# EAGLE design v1 (EAGLE 6.5.0)
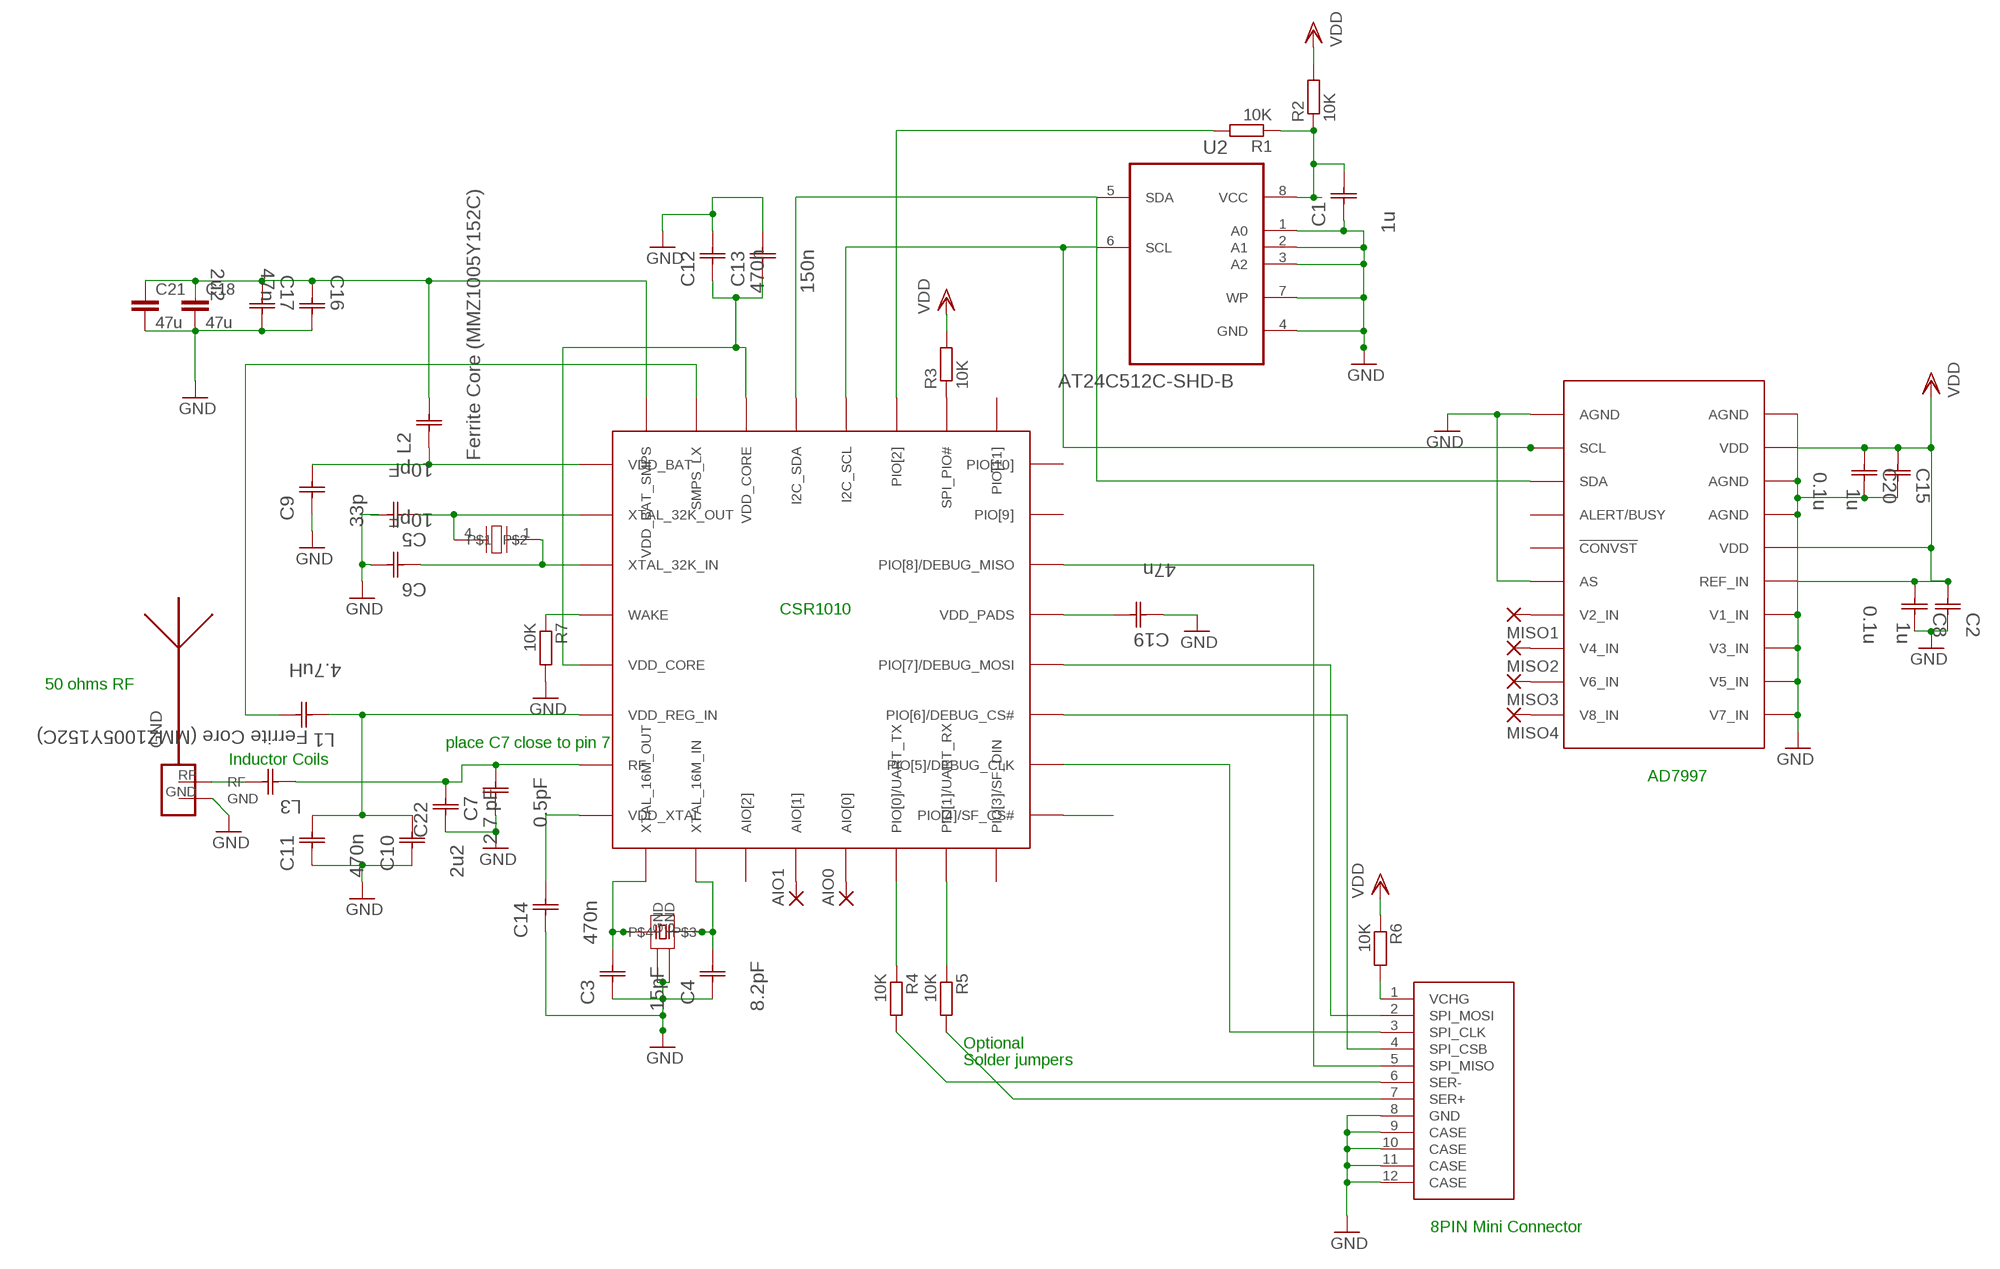
[diagram p0: schematic, sheet 1]

## Parts
AIO0  1,6/0,8  [1,6/0,8]
AIO1  1,6/0,8  [1,6/0,8]
C1  1u  UQCL2A100JAT2A/500  [CAPC1005X60N]
C2  1u  UQCL2A100JAT2A/500  [CAPC1005X60N]
C3  15pF  UQCL2A150JAT2A/500  [CAPC1005X60N]
C4  8.2pF  UQCL2A8R2CAT2A/500  [CAPC1005X60N]
C5  10pF  UQCL2A100JAT2A/500  [CAPC1005X60N]
C6  10pF  UQCL2A100JAT2A/500  [CAPC1005X60N]
C7  0.5pF  UQCL2A0R5BAT2A/500  [CAPC1005X60N]
C8  0.1u  UQCL2A100JAT2A/500  [CAPC1005X60N]
C9  33p  UQCL2A100JAT2A/500  [CAPC1005X60N]
C10  2u2  UQCL2A100JAT2A/500  [CAPC1005X60N]
C11  470n  UQCL2A100JAT2A/500  [CAPC1005X60N]
C12  470n  UQCL2A100JAT2A/500  [CAPC1005X60N]
C13  150n  UQCL2A100JAT2A/500  [CAPC1005X60N]
C14  470n  UQCL2A100JAT2A/500  [CAPC1005X60N]
C15  1u  UQCL2A100JAT2A/500  [CAPC1005X60N]
C16  47n  UQCL2A1R0BAT2A/500  [CAPC1005X60N]
C17  2u2  UQCL2A1R0BAT2A/500  [CAPC1005X60N]
C18  47u  C-EUC0805  [C0805]
C19  47n  UQCL2A100JAT2A/500  [CAPC1005X60N]
C20  0.1u  UQCL2A100JAT2A/500  [CAPC1005X60N]
C21  47u  C-EUC0805  [C0805]
C22  2.7 pF  UQCL2A0R5BAT2A/500  [CAPC1005X60N]
GND  ANTENNA_1LEFT  [SWRA117D_LEFT]
L1  4.7uH  12107C102JAT2A  [CAPC3225X127N]
L2  Ferrite Core (MMZ1005Y152C)  UQCL2A100JAT2A/500  [CAPC1005X60N]
L3  Ferrite Core (MMZ1005Y152C)  UQCL2A100JAT2A/500  [CAPC1005X60N]
MISO1  1,6/0,8  [1,6/0,8]
MISO2  1,6/0,8  [1,6/0,8]
MISO3  1,6/0,8  [1,6/0,8]
MISO4  1,6/0,8  [1,6/0,8]
R1  10K  R-EU_R0402  [R0402]
R2  10K  R-EU_R0402  [R0402]
R3  10K  R-EU_R0402  [R0402]
R4  10K  R-EU_R0402  [R0402]
R5  10K  R-EU_R0402  [R0402]
R6  10K  R-EU_R0402  [R0402]
R7  10K  R-EU_R0402  [R0402]
U2  AT24C512C-SHD-B  [SOIC127P798X216-8N]
U$1  CSR1010A05-IQQM-R  [CSR1010A05-IQQM-R]
U$2  8PIN_SMT_CONNECTOR  [8PIN_SMT_CONNECTOR]
U$3  TSX3225  [TSX3225]
U$4  SSP-T7-F  [SSP-T7-F]
U$5  AD7997  [AD7997]

## Nets
GND: C1.2(C1) C2.2(C1) C3.2(C1) C4.2(C1) C6.1(C2) C7.2(C1) C8.2(C1) C9.2(C1) C10.2(C1) C11.2(C1) C12.1(C2) C13.1(C2) C14.2(C1) C15.2(C1) C16.1(C2) C17.1(C2) C18.2 C19.2(C1) C20.2(C1) C21.2 C22.2(C1) R7.2 U2.1(A0) U2.2(A1) U2.3(A2) U2.4(GND) U2.7(WP) U$2.8(GND) U$2.9(CASE) U$2.10(CASE) U$2.11(CASE) U$2.12(CASE) U$3.2(GND) U$3.4(GND) U$5.P$01(AGND) U$5.P$03(AGND) U$5.P$04(AGND) U$5.P$07(V1_IN) U$5.P$08(V3_IN) U$5.P$09(V5_IN) U$5.P$010(V7_IN) U$5.P$015(AS) U$5.P$020(AGND)
N$1: R3.1 U$1.SPI_PIO#
N$3: R1.2 U$1.PIO[2]
N$4: C1.1(C2) R1.1 R2.1 U2.8(VCC)
N$18: U$1.PIO[8]/DEBUG_MISO U$2.5(SPI_MISO)
N$19: L1.2(C2) U$1.SMPS_LX
N$20: R4.2 U$2.6(SER-)
N$23: U$1.PIO[4]/SF_CS#
N$26: C5.2(C1) U$1.XTAL_32K_OUT U$4.4
N$27: C6.2(C1) U$1.XTAL_32K_IN U$4.1
N$28: AIO0.1(P) U$1.AIO[0]
N$29: C3.1(C2) U$1.XTAL_16M_OUT U$3.1
N$30: C4.1(C2) U$1.XTAL_16M_IN U$3.3
N$31: U$1.PIO[6]/DEBUG_CS# U$2.4(SPI_CSB)
N$32: C9.1(C2) L2.2(C1) U$1.VDD_BAT
N$33: AIO1.1(P) U$1.AIO[1]
N$35: C14.1(C2) U$1.VDD_XTAL
N$36: R5.2 U$2.7(SER+)
N$37: R4.1 U$1.PIO[0]/UART_TX
N$38: R5.1 U$1.PIO[1]/UART_RX
N$39: C10.1(C2) C11.1(C2) L1.1(C1) U$1.VDD_REG_IN
N$40: R6.2 U$2.1(VCHG)
N$43: C7.1(C2) C22.1(C2) L3.2(C1) U$1.RF
N$46: MISO1.1(P) U$5.P$014(V2_IN)
N$49: R7.1 U$1.WAKE
N$50: U$1.PIO[7]/DEBUG_MOSI U$2.2(SPI_MOSI)
N$51: U$1.PIO[5]/DEBUG_CLK U$2.3(SPI_CLK)
N$73: MISO3.1(P) U$5.P$012(V6_IN)
N$82: MISO2.1(P) U$5.P$013(V4_IN)
N$83: MISO4.1(P) U$5.P$011(V8_IN)
N$87: C19.1(C2) U$1.VDD_PADS
N$110: U2.5(SDA) U$1.I2C_SDA U$5.P$018(SDA)
N$135: C16.2(C1) C17.2(C1) C18.1 C21.1 L2.1(C2) U$1.VDD_BAT_SMPS
SCL: U2.6(SCL) U$1.I2C_SCL U$5.P$019(SCL)
VDD: C2.1(C2) C8.1(C2) C15.1(C2) C20.1(C2) R2.2 R3.2 R6.1 U$5.P$02(VDD) U$5.P$05(VDD) U$5.P$06(REF_IN)
VDD_CORE: C12.2(C1) C13.2(C1) U$1.VDD_CORE U$1.VDD_CORE@1(VDD_CORE)
Unconnected: C5.1(C2) GND.GND GND.RF L3.1(C2) U$1.AIO[2] U$1.PIO[3]/SF_DIN U$1.PIO[9] U$1.PIO[10] U$1.PIO[11] U$5.P$016(!CONVST) U$5.P$017(ALERT/BUSY)

## Notes on the sheet
- CSR1010
- 50 ohms RF
- place C7 close to pin 7
- Inductor Coils
- AD7997
- Optional
- Solder jumpers
- 8PIN Mini Connector

## Library data of the parts
AIO0 AIO1 MISO1-MISO4 = wirepad:1,6/0,8: THROUGH-HOLE PAD
C1 C2 C8-C15 C19 C20 L2 L3 = AVX_By_element14_Batch_1:UQCL2A100JAT2A/500: Capacitor 0402; MPN: UQCL2A100JAT2A/500; OC_FARNELL: -; OC_NEWARK: 32T8791; SUPPLIER: AVX; TOLERANCE: ±5%; VALUE: 10pF; VOLTAGERATING: 200V
C3 = AVX_By_element14_Batch_1:UQCL2A150JAT2A/500: Capacitor 0402; MPN: UQCL2A150JAT2A/500; OC_FARNELL: -; OC_NEWARK: 32T8795; SUPPLIER: AVX; TOLERANCE: ±5%; VOLTAGERATING: 200V
C4 = AVX_By_element14_Batch_1:UQCL2A8R2CAT2A/500: Capacitor 0402; MPN: UQCL2A8R2CAT2A/500; OC_FARNELL: -; OC_NEWARK: 32T8828; SUPPLIER: AVX; TOLERANCE: ±.25 pF; VOLTAGERATING: 200V
C5 C6 = AVX_By_element14_Batch_1:UQCL2A100JAT2A/500: Capacitor 0402; MPN: UQCL2A100JAT2A/500; OC_FARNELL: -; OC_NEWARK: 32T8791; SUPPLIER: AVX; TOLERANCE: ±5%; VOLTAGERATING: 200V
C7 = AVX_By_element14_Batch_1:UQCL2A0R5BAT2A/500: Capacitor 0402; MPN: UQCL2A0R5BAT2A/500; OC_FARNELL: -; OC_NEWARK: 32T8767; SUPPLIER: AVX; TOLERANCE: ±.1 pF; VOLTAGERATING: 200V
C16 C17 = AVX_By_element14_Batch_1:UQCL2A1R0BAT2A/500: Capacitor 0402; MPN: UQCL2A1R0BAT2A/500; OC_FARNELL: -; OC_NEWARK: 32T8778; SUPPLIER: AVX; TOLERANCE: ±.1 pF; VALUE: 1pF; VOLTAGERATING: 200V
C18 C21 = resistor:C-EU: CAPACITOR, European symbol
C22 = AVX_By_element14_Batch_1:UQCL2A0R5BAT2A/500: Capacitor 0402; MPN: UQCL2A0R5BAT2A/500; OC_FARNELL: -; OC_NEWARK: 32T8767; SUPPLIER: AVX; TOLERANCE: ±.1 pF; VALUE: 0.5pF; VOLTAGERATING: 200V
GND = ant-planar-1:ANTENNA_1
L1 = AVX_By_element14_Batch_1:12107C102JAT2A: Capacitor 1210; MPN: 12107C102JAT2A; OC_FARNELL: -; OC_NEWARK: 56J0850; SUPPLIER: AVX; TOLERANCE: ±5%; VALUE: 1000PF; VOLTAGERATING: 500V
R1-R7 = rcl:R-EU_: RESISTOR, European symbol
U2 = ATMEL-AT24C512C-SHD-B:AT24C512C-SHD-B: EEPROM, SERIAL, 512K (64KX8), 8SOIC-Wide; MPN: AT24C512C-SHD-B; OC_FARNELL: 1972003; OC_NEWARK: 68T4124; PACKAGE: 8SOIC-Wide; SUPPLIER: ATMEL
U$1 = CSR1010A05:CSR1010A05-IQQM-R
U$2 = MINI_SMT_8_PIN_CONNECTOR:8PIN_SMT_CONNECTOR
U$3 = TSX3225:TSX3225
U$4 = SSP-T7-F:SSP-T7-F
U$5 = AD7997:AD7997

## Board
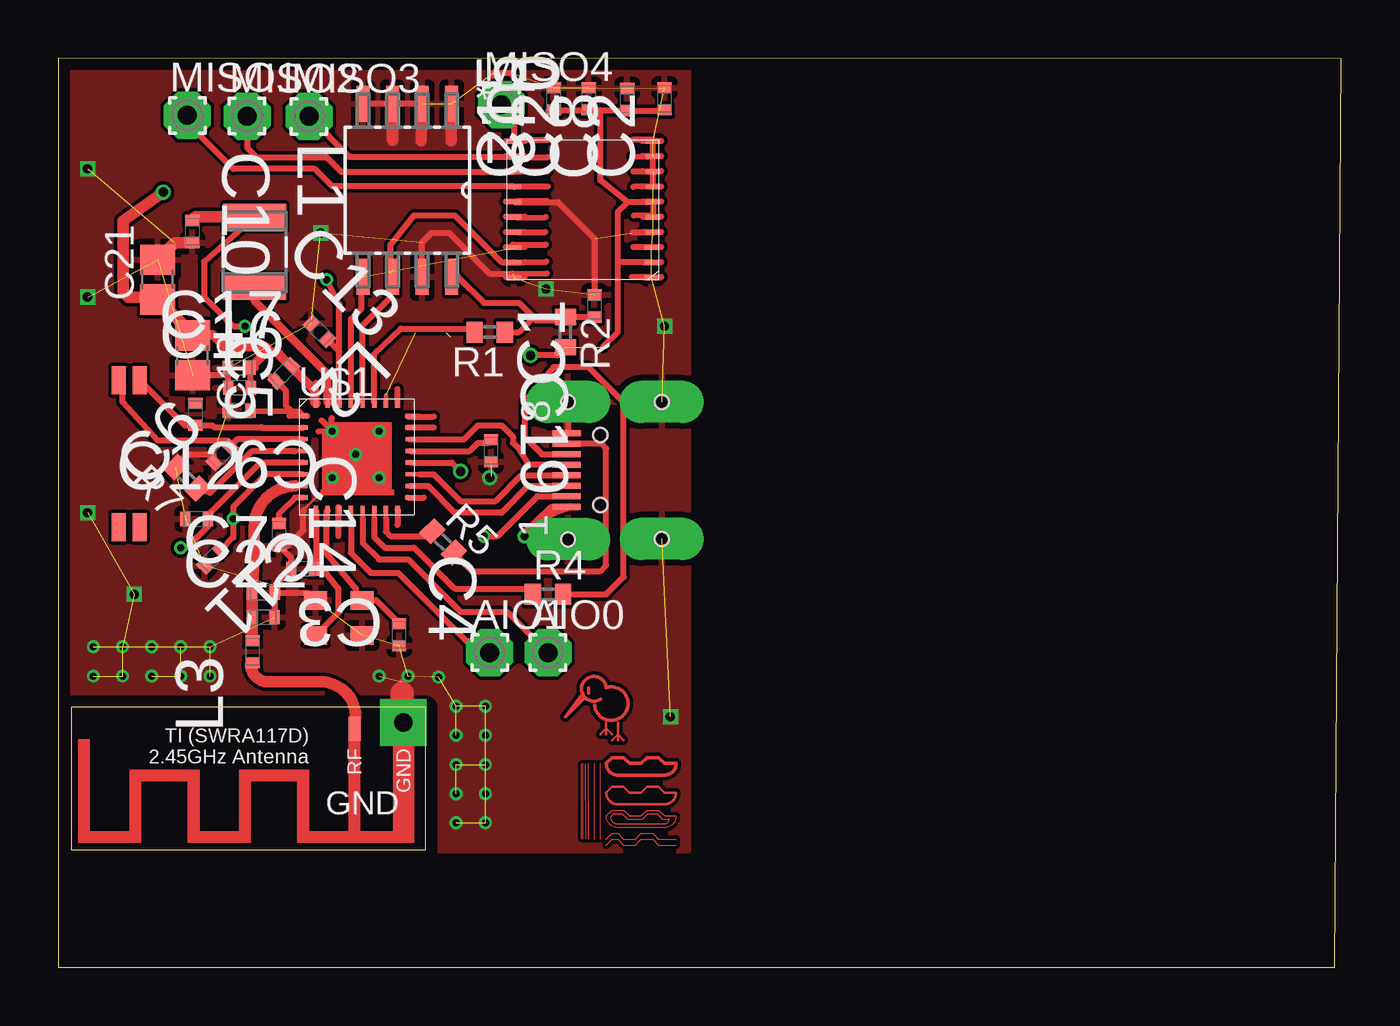
[diagram p1: board, top side]
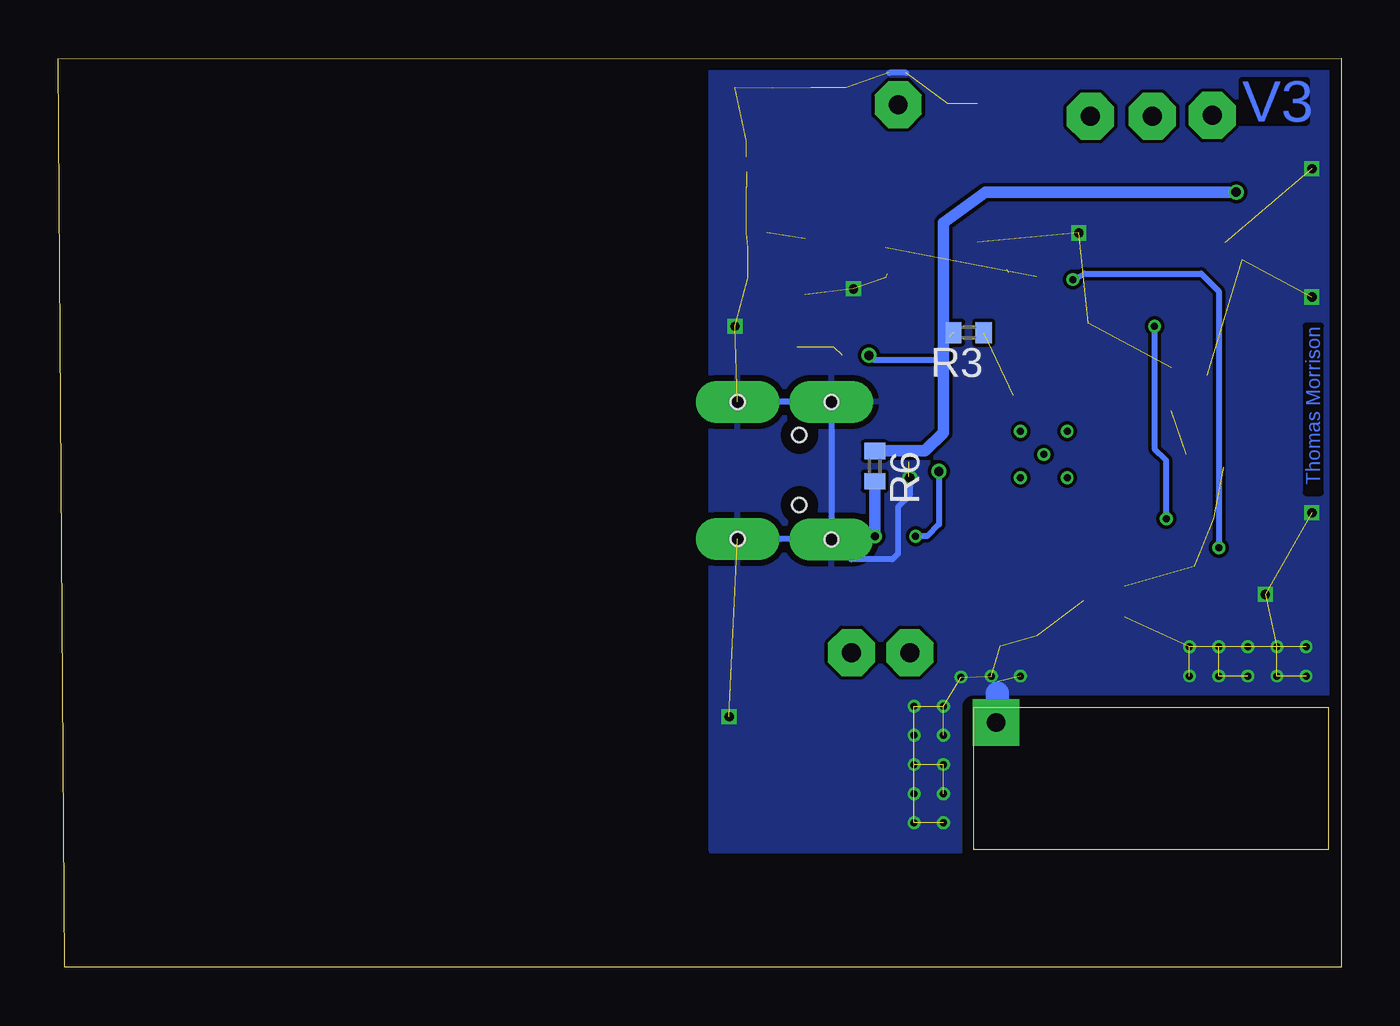
[diagram p2: board, bottom side, seen from below]

Size 55.04 x 38.99 mm. Coordinates in mm from the lower left corner, seen from the top.
Outline: 0.01,0 54.76,0 55.04,38.98 0,38.99 0.01,0
Copper layers (1*16): Top 0.035mm / dielectric 1.5mm / Bottom 0.035mm
Design rules "DRC *": minimum track width 0.15mm, minimum drill 0.2mm, track to track 0.15mm, track to pad 0.15mm, pad to pad 0.15mm, via to via 0.25mm, smd to smd 0.15mm, copper to edge 0.5mm, drill to drill 0.4mm, minimum pad ring 0.6mm, minimum via ring 0.125mm, stop-mask expansion 4mil, vias tented up to drill 0mil, thermal gap 10mil

### Footprints (pad centres in the part's own frame; a part is rotated, then mirrored left to right if it is on the bottom)
1,6/0,8 = drill 0.813 pad 1.6 octagon: 1 0,0
CAPC1005X60N = smd 0.457 x 0.61: 1 -0.483,0; 2 0.483,0
C0805 = smd 1.3 x 1.5: 1 -0.85,0; 2 0.85,0
SWRA117D_LEFT = drill 0.8 square: GND 0.45,0.25 | smd 0.508 x 1.016: RF 2.55,0.51
CAPC3225X127N = smd 1.118 x 2.692: 1 -1.499,0; 2 1.499,0
R0402 = smd 0.7 x 0.9: 1 -0.65,0; 2 0.65,0
SOIC127P798X216-8N = smd 1.549 x 0.559: 1 -3.708,1.905; 2 -3.708,0.635; 3 -3.708,-0.635; 4 -3.708,-1.905; 5 3.708,-1.905; 6 3.708,-0.635; 7 3.708,0.635; 8 3.708,1.905
CSR1010A05-IQQM-R = smd 0.186 x 0.4: AIO[0] -0.2,-0.9; AIO[1] -0.7,-0.9; AIO[2] -1.2,-0.9; I2C_SCL -0.2,3.7; I2C_SDA -0.7,3.7; PIO[0]/UART_TX 0.3,-0.9; PIO[1]/UART_RX 0.8,-0.9; PIO[2] 0.3,3.7; SMPS_LX -1.7,3.7; SPI_PIO# 0.8,3.7; VDD_CORE@1 -1.2,3.7; XTAL_16M_IN -1.7,-0.9 | smd 0.2 x 0.4: PIO[3]/SF_DIN 1.3,-0.9; PIO[11] 1.3,3.7; VDD_BAT_SMPS -2.2,3.7; XTAL_16M_OUT -2.2,-0.9 | smd 0.4 x 0.2: PIO[4]/SF_CS# 1.85,-0.35; PIO[10] 1.85,3.15; VDD_BAT -2.75,3.15; VDD_XTAL -2.75,-0.35 | smd 0.4 x 0.186: PIO[5]/DEBUG_CLK 1.85,0.15; PIO[6]/DEBUG_CS# 1.85,0.65; PIO[7]/DEBUG_MOSI 1.85,1.15; PIO[8]/DEBUG_MISO 1.85,2.15; PIO[9] 1.85,2.65; RF -2.75,0.15; VDD_CORE -2.75,1.15; VDD_PADS 1.85,1.65; VDD_REG_IN -2.75,0.65; WAKE -2.75,1.65; XTAL_32K_IN -2.75,2.15; XTAL_32K_OUT -2.75,2.65
8PIN_SMT_CONNECTOR = smd 0.26 x 1.2: 1 -1.32,2.83; 2 -0.87,2.83; 3 -0.42,2.83; 4 0.03,2.83; 5 0.48,2.83; 6 0.93,2.83; 7 1.38,2.83; 8 1.83,2.83 | drill 0.6 long: 9 3.18,2.755; 10 3.18,-1.27; 11 -2.695,-1.27; 12 -2.72,2.755 | hole 0.6: -2.72,2.755; -2.695,-1.27; 3.18,-1.27; 3.18,2.755; 1.755,1.38; -1.245,1.38
TSX3225 = smd 1 x 0.8: 1 -1,-0.75; 2 1,-0.75; 3 1,0.75; 4 -1,0.75
SSP-T7-F = smd 1.2 x 0.6: 1 -0.6,0.3; 2 5.7,0.3; 3 5.7,1.2; 4 -0.6,1.2
AD7997 = smd 0.6 x 0.2: P$01 -1.7,2.925; P$02 -1.7,2.275; P$03 -1.7,1.625; P$04 -1.75,0.975; P$05 -1.75,0.325; P$06 -1.75,-0.325; P$07 -1.75,-0.975; P$08 -1.75,-1.625; P$09 -1.75,-2.275; P$010 -1.75,-2.925; P$011 4.2,-2.925; P$012 4.2,-2.275; P$013 4.2,-1.625; P$014 4.2,-0.975; P$015 4.2,-0.325; P$016 4.2,0.325; P$017 4.2,0.975; P$018 4.2,1.625; P$019 4.2,2.275; P$020 4.2,2.925

### Placement (x,y rotation side)
AIO0  21.01,13.5 0 top
AIO1  18.51,13.5 0 top
C1  23.01,28.37 90 top
C2  26.01,37.25 90 top
C3  10.49,17.1 180 top
C4  14.63,14.28 270 top
C5  5.89,23.73 270 top
C6  7.02,22 45 top
C7  8.8,16.07 0 top
C8  24.41,37.23 90 top
C9  7.76,23.88 180 top
C10  5.75,31.56 270 top
C11  6.62,17.56 225 top
C12  5.94,19.23 0 top
C13  11.2,27.28 315 top
C14  9.48,18.57 270 top
C15  21.26,37.25 90 top
C16  7.78,24.86 0 top
C17  7.77,25.71 0 top
C18  5.76,26.25 270 top
C19  18.56,22.16 270 top
C20  22.76,37.25 90 top
C21  4.26,29.5 90 top
C22  8.79,15.03 0 top
GND  15.26,10.75 180 top
L1  8.43,30.69 270 top
L2  9.67,25.48 225 top
L3  8.34,13.54 90 top
MISO1  5.54,36.55 0 top
MISO2  8.1,36.51 0 top
MISO3  10.76,36.5 0 top
MISO4  19.01,37 0 top
R1  18.51,27.25 180 top
R2  21.76,27.25 270 top
R3  15.99,27.23 180 bottom
R4  21.01,16 0 top
R5  16.51,18.25 315 top
R6  20.01,21.5 270 bottom
R7  5.51,21 135 top
U2  14.98,33.33 270 top
U$1  13.26,20.5 0 top
U$2  24.62,21.07 90 top
U$3  12.04,14.99 0 top
U$4  2.29,24.58 270 top
U$5  23.76,32.5 180 top

### Tracks (layer width: path | path; a pad name or v marks a point on that pad's centre or on a via)
GND  (via drill 0.3, 0.4)  (59 unrouted)
  Top 0.125: 11.51,20.5 11.41,20.5 10.53,19.62
  Top 0.25: U2.2 U2.3 U2.4 | C6.1 6.64,22 5.51,22 5.05,21.54 R7.2 | U2.7 15.61,31.11 16.01,31.5 16.76,31.5 18.51,29.75 19.48,29.75 | U$2.9 21.87,22.98 U$2.8 | C7.2 9.28,16.37 C3.2 10,17.55 C14.2 9.84,18.08 10.51,18.75 10.51,19.59 10.53,19.62 | C7.2 10.71,16.07 U$3.4 | C7.2 9.27,16.06 C22.2 | 18.67,38.37 19.43,38.37 | 18.56,21.05 v18.51,21 | 7.26,25.4 C18.2 | 7.26,25.4 7.26,24.4 C9.2 C16.1 | C17.1 7.28,25.42 7.26,25.4 | U$5.P$015 21.43,32.83 23.01,31.25 C1.2 | v15.01,12.5 14.76,12.25 14.76,11.75 | U$5.P$07 U$5.P$010 | U$5.P$04 25.51,31.5 24.64,31.51
  Top 0.5: U2.3 14.34,35.47 | U2.2 15.57,35.46 | U2.1 16.86,35.46 | C21.2 4.98,31.08 C10.2
  Top 1: 14.76,10.5 14.76,11.75
  Bottom 0.25: U$2.10 U$2.9 U$2.12 | U$2.12 U$2.11 | 18.67,38.36 19.39,38.36 19.39,38.35 | v18.51,21 18.51,20.25 19.01,19.75 19.01,17.75 19.26,17.5 21.01,17.5 U$2.12
  Bottom 1: 14.76,10.5 14.76,11.75
  other vias: 16.32,12.46 6.51,12.5 5.26,12.5 4.01,12.5 2.76,12.5 1.51,12.5 13.76,12.5 1.51,13.75 2.76,13.75 4.01,13.75 5.26,13.75 6.51,13.75 17.07,11.21 17.07,9.96 17.07,8.71 17.07,7.46 17.07,6.21 18.32,6.21 18.32,7.46 18.32,8.71 18.32,9.96 18.32,11.21 26.01,27.5 1.26,28.75 1.26,19.5 1.26,34.25 11.26,31.5 26.26,10.75 3.26,16 20.93,29.1
  pour Top: 0.51,38.75 27.01,38.75 27.01,5 0.51,5
  pour Bottom: 0.51,5 27.01,5 27.01,38.75 0.51,38.75
N$1  (1 unrouted)
N$3
  Top 0.25: U$1.PIO[2] 13.56,26.3 14.71,27.39 17.71,27.39 R1.2
N$4
  Top 0.25: C1.1 22.99,27.9 R2.1 21.61,27.75 20.51,27.75 20.38,27.88 | U2.8 17.13,29.62 18.26,28.5 19.76,28.5 20.38,27.88 | R1.1 19.76,27.25 20.38,27.88
N$8  (via drill 0.3)
  other vias: 11.76,23
N$10  (via drill 0.3)
  other vias: 13.76,23
N$12  (via drill 0.3)
  other vias: 12.76,22
N$14  (via drill 0.3)
  other vias: 11.76,21
N$16  (via drill 0.3)
  other vias: 13.76,21
N$17
  Top 0.25: 14.55,24.2 14.55,24.81
N$18
  Top 0.25: U$1.PIO[8]/DEBUG_MISO 17.41,22.65 18.01,23.25 19.01,23.25 19.51,22.75 19.51,22.5 19.76,22.25 20.2,21.57 U$2.5
N$19
  Top 0.3: 8.43,28.83 L1.2
  Top 0.35: U$1.SMPS_LX 11.56,25.45 8.43,28.58 L1.2
N$20
  Top 0.25: 22.29,22 U$2.6 20.75,22 20.01,22.75 20.01,24.25 21.26,25.75 22.76,25.75 24.26,24.25 24.26,16.75 23.51,16 R4.2
N$21
  Top 0.25: 14.55,19.65 14.55,18.98
N$24
  Top 0.25: 15,20.14 15.69,20.14
N$26
  Top 0.25: U$4.4 5.43,23.24 C5.2 6.61,23.24 6.69,23.17 8.71,23.17 8.73,23.15 U$1.XTAL_32K_OUT
N$27
  Top 0.25: U$4.1 2.76,25.01 2.76,24.25 4.26,22.59 7.26,22.59 C6.2 7.67,22.65 U$1.XTAL_32K_IN
N$28
  Top 0.25: 13.06,19.25 13.06,18.28 13.06,18.2 13.76,17.5 15.01,17.5 17.26,15.25 19.26,15.25 AIO0.1
N$29
  Top 0.25: U$1.XTAL_16M_OUT 11.06,17.45 11.13,17.35 | 11.13,17.35 12.01,16.25 12.01,15.21 U$3.1 | C3.1 10.97,17.19 11.13,17.35
N$30
  Top 0.25: U$1.XTAL_16M_IN 11.51,19.55 11.51,17.75 12.76,16.25 12.76,16.02 U$3.3 13.02,15.74 13.01,15.75 13.63,15.75 C4.1
N$31
  Top 0.25: 15.51,21.15 16.11,21.15 17.26,20 18.76,20 19.86,21.11 U$2.4
N$32
  Top 0.25: 9.09,25.38 L2.2 9.51,25 9.76,24.75 9.76,24.1 10,23.85 | C9.1 10,23.85 | 10,23.85 10.31,23.85 U$1.VDD_BAT
N$33
  Top 0.25: 12.56,19.25 12.56,17.77 13.4,16.92 14.59,16.92 17.51,14 18.01,14 AIO1.1
N$35
  Top 0.25: U$1.VDD_XTAL 10.16,20.15 9.48,19.47 C14.1
N$36
  Top 0.25: U$2.7 23.3,22.45 23.51,22.25 23.51,17.25 23.26,17 17.76,17 R5.2 | R5.2
N$37
  Top 0.25: 13.56,19.25 13.56,18.45 14.01,18 15.26,18 17.01,16.25 20.11,16.25 R4.1
N$38
  Top 0.25: 14.06,19.25 14.06,18.7 14.26,18.5 15.84,18.5 R5.1
N$39  (via drill 0.3)
  Top 0.25: U$1.VDD_REG_IN 8.91,21.15 7.51,19.75 v7.51,19.25 7.51,18.45 C11.1 | L1.1 6.26,30.27 6.26,28.75 7.51,27.5 v8.01,27.5
  Top 0.5: C10.1 5.9,32.19 L1.1
  Bottom 0.25: v8.01,27.5 8.01,22.25 7.51,21.75 v7.51,19.25
N$40  (via drill 0.35)
  Top 0.25: U$2.1 21.18,19.62
  Top 0.5: v20.01,18.5 21.18,19.62
  Bottom 0.5: R6.2 v20.01,18.5
N$43
  Top 0.5: 10.16,20.65 arc90 8.41,18.91 8.41,17.5 C7.1 8.32,15.03 C22.1 8.31,14.06 L3.2
N$46
  Top 0.25: U$5.P$014 19.53,33.5 | 19.53,33.5 11.76,33.5 11.01,34.25 7.51,34.25 5.54,36.22 MISO1.1 | 19.53,33.5 21.01,33.5
N$49
  Top 0.25: 10.16,22.15 10.14,22.13 8.29,22.13 6.51,20.35 R7.1
N$50  (via drill 0.3, 0.4)
  Top 0.25: v18.26,18.5 18.85,18.5 20.5,20.15 20.5,20.16 20.56,20.21 21.78,20.21 U$2.2 | U$1.PIO[7]/DEBUG_MOSI 16.88,21.65 v17.26,21.27
  Bottom 0.25: v17.26,21.27 17.26,19 17.76,18.5 v18.26,18.5
N$51
  Top 0.25: U$1.PIO[5]/DEBUG_CLK 15.86,20.65 17.01,19.5 19.01,19.5 20.16,20.66 U$2.3
N$73
  Top 0.25: U$5.P$012 12.53,34.77 12.51,34.75 MISO3.1
N$82
  Top 0.25: U$5.P$013 12.13,34.12 11.51,34.75 8.51,34.75 8.1,35.16 MISO2.1
N$83
  Top 0.25: MISO4.1 19.56,36.45 U$5.P$011
N$86
  Top 0.25: 12.01,19.75 12.01,18.5
N$87
  Top 0.25: U$1.VDD_PADS 17.65,22.14 18.01,22.5 18.42,22.5 C19.1
N$88
  Top 0.25: 14.99,23.62 16.11,23.62
N$89
  Top 0.25: 15,23.16 16.11,23.16
N$90
  Top 0.25: 11.08,24.29 11.06,25.07
N$91
  Top 0.25: 19.51,29.75 20.96,29.77
N$92
  Top 0.25: 19.51,31 20.92,31
N$93
  Top 0.25: 19.51,34.75 21.01,34.75
N$94
  Top 0.25: 19.67,34.16 20.98,34.15
N$95
  Top 0.25: 20.95,32.87 19.62,32.85
N$96
  Top 0.25: 19.67,32.16 20.91,32.17
N$97
  Top 0.25: 19.69,31.54 20.89,31.54
N$98
  Top 0.25: 25.37,29.61 24.61,29.61
N$99
  Top 0.25: 25.44,30.89 24.67,30.89
N$100
  Top 0.25: 25.51,32.25 24.68,32.24
N$101
  Top 0.25: 25.01,33.5 24.67,33.48
N$102
  Top 0.25: 25.4,34.13 24.66,34.13
N$103
  Top 0.25: 25.26,34.75 24.63,34.77
N$104
  Top 0.25: 25.51,35.5 24.63,35.49
N$105
  Top 0.25: 19.51,35.5 21.01,35.5
N$106
  Top 0.25: 10.68,23.64 9.92,23.65
N$108
  Top 0.3: 21.26,19.75 22.01,19.75 | 22.01,19.75 22.26,19.75 | 22.01,19.75 21.26,19.5
N$109
  Top 0.5: 8.26,13 arc90 9.01,12.25 11.26,12.25 arc-90 12.76,10.75
N$110  (1 unrouted)
  Top 0.25: 12.56,24.55 12.56,27.8 13.01,28.25 13.01,29.56 U2.5
N$112
  Top 0.25: 18.76,38.25 18.63,38.25 18.63,38.37 19.51,38.37 19.51,38.25
N$113
  Top 0.25: 12.01,22.75 11.3,23.46
N$115
  Top 0.05: 23.51,6.5 23.76,6.75 24.26,6.75 24.51,6.5 25.01,6.5 25.26,6.75 25.76,6.75 26.01,6.5 26.51,6.5 arc-90 26.01,6 24.01,6 arc-90 23.51,6.5
N$116
  Top 0.1: 23.51,7.5 23.76,7.75 24.26,7.75 24.51,7.5 25.01,7.5 25.26,7.75 25.76,7.75 26.01,7.5 26.51,7.5 arc-90 26.01,7 24.01,7 arc-90 23.51,7.5
N$117
  Top 0.15: 23.76,9 24.26,9 24.51,8.75 25.01,8.75 25.26,9 25.76,9 26.01,8.75 26.51,8.75 arc-90 26.01,8.25 24.01,8.25 arc-90 23.51,8.75 23.76,9
N$118
  Top 0.05: 23.7,6.46 23.82,6.58 24.19,6.58 24.37,6.41 24.43,6.36 25.07,6.36 25.31,6.59
N$119
  Top 0.05: 25.32,6.6 25.68,6.6 25.92,6.37 26.19,6.37 26.2,6.37 arc-90 25.96,6.13 24.02,6.13 arc-90 23.71,6.45
N$120
  Top 0.25: 11.75,23.05 11.73,23.57
N$121
  Top 0.05: 23.51,5.25 23.76,5.5 24.01,5.5 24.26,5.25 24.76,5.25 25.01,5.5 25.51,5.5 25.76,5.25 26.51,5.25
N$122
  Top 0.05: 23.51,5.5 23.76,5.75 24.01,5.75 24.26,5.5 24.76,5.5 25.01,5.75 25.51,5.75 25.76,5.5 26.51,5.5
N$123
  Top 0.01: 23.26,5.5 23.26,8.75
N$124
  Top 0.01: 23.01,5.5 23.01,8.75
N$125
  Top 0.01: 22.76,5.5 22.76,8.75
N$126
  Top 0.01: 22.51,5.5 22.51,8.75
N$127
  Top 0.01: 22.63,5.51 22.63,8.74
N$128
  Top 0.01: 22.43,8.73 22.43,5.53
N$129
  Top 0.25: 11.68,22.98 11.17,22.99
N$130
  Top 0.15: 23.26,11.5 arc-297 23.51,12 arc-282 23.01,11.25
N$131
  Top 0.15: 22.51,11.75 21.76,10.75 22.51,11.5
N$132
  Top 0.15: 22.76,12 22.76,11.75
N$133
  Top 0.1: 23.51,10.5 23.51,10.25 | 23.51,10.25 23.26,10 | 23.51,10 23.51,10.25 | 23.51,10.25 23.76,10
N$134
  Top 0.1: 24.01,10.5 24.01,10 | 24.01,10 23.76,9.75 | 24.01,9.75 24.01,10 | 24.01,10 24.26,9.75
N$135
  Top 0.25: U$1.VDD_BAT_SMPS 11.06,24.45 | 9.13,26.38 9.01,26.5 | C16.2 8.26,25.7 C17.2 8.47,25.71
  Top 0.4: 6.38,27.12 6.62,27.12 7.13,26.61 8.9,26.61 9.01,26.5 | 9.93,25.82 11.01,24.75 11.01,24.25 U$1.VDD_BAT_SMPS | C17.2 8.91,26.38 9.13,26.38 9.38,26.38 9.63,26.12 9.93,25.82 | L2.1 9.93,25.82
  Top 0.5: 6.38,27.12 5.78,27.12 C18.1 5.76,27.15 C21.1
SCL  (1 unrouted)
  Top 0.25: 14.34,29.91 14.26,30 14.26,31 15.26,32.25 17.01,32.25 19.01,30.25 19.53,30.25 | 19.53,30.25 U$5.P$019 | 19.53,30.25 20.94,30.27 | 13.06,24.55 13.06,27.55 14.26,28.75 14.26,29.79 U2.6
VDD  (via drill 0.4)  (3 unrouted)
  Top 0.25: 21.41,26.25 v20.26,26.25 | 23.36,26.6 24.01,27.25 24.01,30.25 | U$5.P$02 25.43,30.25 24.01,30.25 | C2.1 25.98,36.74 C8.1 23.26,36.74 | 23.26,36.74 21.03,36.74 C15.1 | 24.43,32.83 U$5.P$06 U$5.P$05 | 24.43,32.83 23.26,33.75 23.26,36.74 | 24.01,30.25 24.01,32.4 24.43,32.83 | C20.1 23.23,36.77 23.26,36.74
  Top 0.5: v4.51,33.25 2.78,32.03 2.78,28.97 3.01,28.75 4.16,28.75
  Bottom 0.25: v20.26,26.25 20.08,26.07 17.07,26.07 | 16.82,27.05 17.07,27.05
  Bottom 0.5: R6.1 17.86,22.15 17.07,22.94 17.07,26.07 17.07,27.05 17.07,31.94 15.26,33.25 v4.51,33.25
VDD_CORE  (via drill 0.3)
  Top 0.25: 12.06,24.55 12.06,26.42 C13.2 | U$1.VDD_CORE@1 12.06,28.45 v11.51,29.5 | v5.26,18 5.51,18 6.42,18.92 C12.2 6.42,19.42 8.66,21.65 U$1.VDD_CORE
  Bottom 0.25: v11.51,29.5 11.01,29.75 6.01,29.75 5.26,29 v5.26,18
(copper drawn outside any net)
  shapes: Top area x1

### Text on the board
Bottom: V3 | Thomas Morrison